# Altium schematic sheet SF_driver.SchDoc
size 420 x 297 mm; Address1: Address1; Address2: Address2; Address3: Address3; Address4: Address4; DocumentNumber: *Э3; SheetNumber: 15; SheetTotal: 15; DocumentType: Схема электрическая *
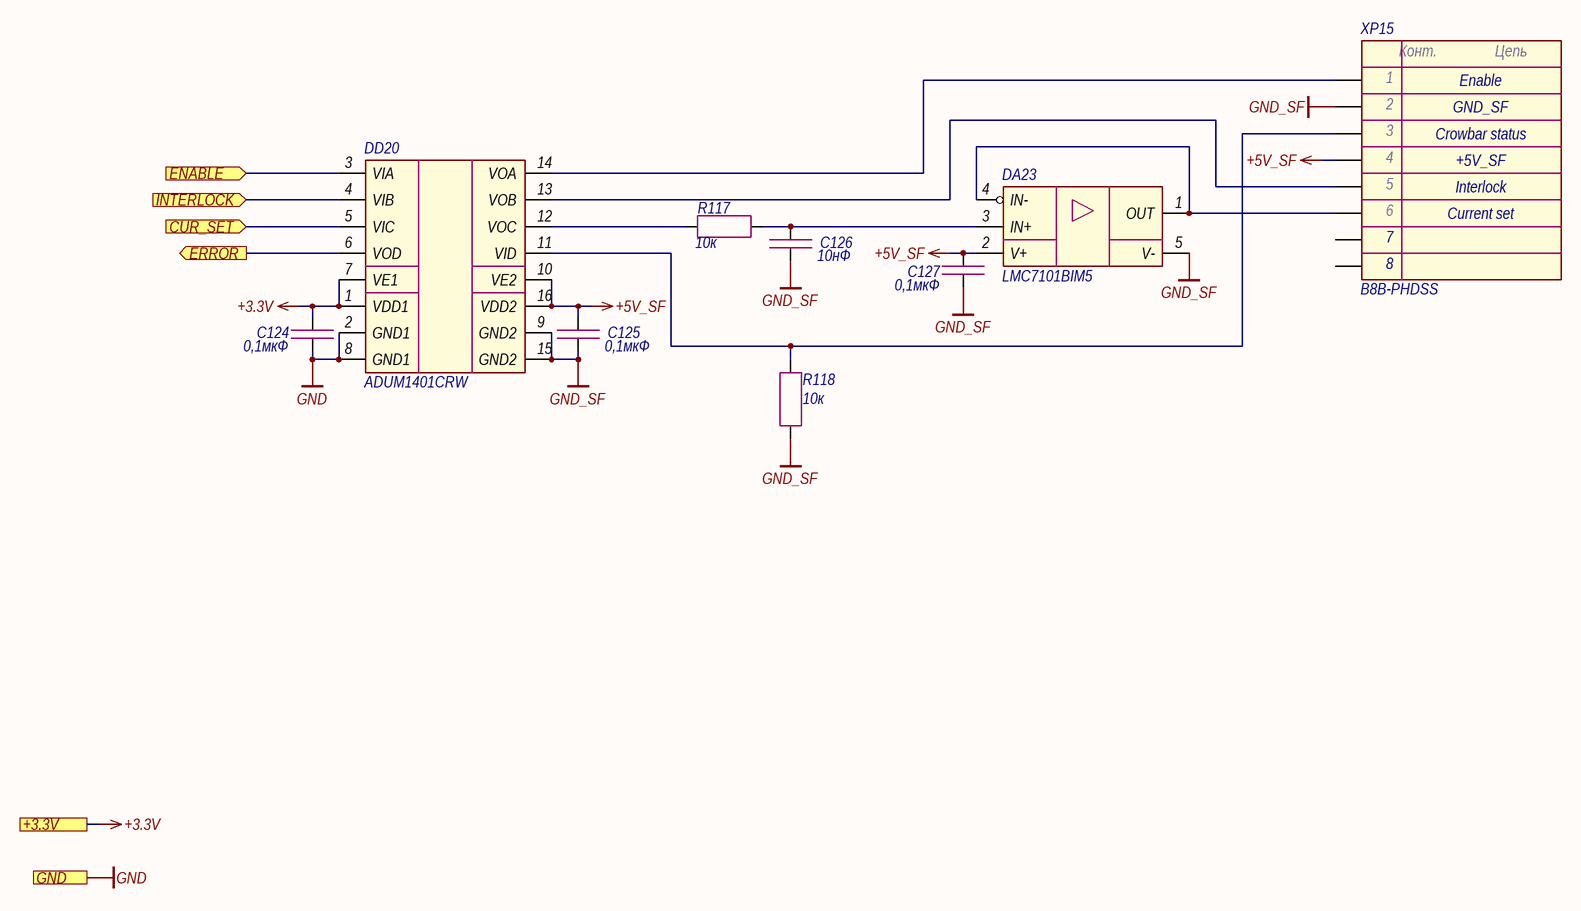
[diagram p0: SF_driver.SchDoc]

## Parts
C124  0,1мкФ  [CAP_0603]
C125  0,1мкФ  [CAP_0603]
C126  10нФ  [CAP_0603]
C127  0,1мкФ  [CAP_0603]
DA23  LMC7101BIM5  [SOT-23-5]
DD20  ADUM1401CRW  [SOIC-16W]
R117  10к  [RES_0603]
R118  10к  [RES_0603]
XP15  B8B-PHDSS  [B8B-PHDSS]

## Ports
+3.3V (see Main[1D], Button[1D], Ethernet[3D], Fiber_interlock[2C], Flow_sensor[2C], Hardwiring[3D], LD_driver[1D], Power_supply[1D], Power_supply_CAN[1D]), CUR_SET (in, see Main[1D]), ENABLE (in, see Main[1D]), ERROR (out, see Main[1D]), GND (see Main[1D], Button[1D], Column[1C], Ethernet[3D], Fiber_interlock[2C], Flow_sensor[2C], Guide_laser[1C], Hardwiring[3D], Indication[1C], LD_driver[1D], Power_supply[1D], Power_supply_CAN[1D]), INTERLOCK (in, see Main[1D])

## Nets
+3.3V: C124.1 DD20.1(VDD1) DD20.7(VE1) ; port +3.3V
+5V_SF: C125.1 C127.1 DA23.2(V+) DD20.10(VE2) DD20.16(VDD2) XP15.4
GND: C124.2 DD20.2(GND1) DD20.8(GND1) ; port GND
GND_SF: C125.2 C126.2 C127.2 DA23.5(V-) DD20.9(GND2) DD20.15(GND2) R118.1 XP15.2
CUR_SET: DD20.5(VIC) ; port CUR_SET
ENABLE: DD20.3(VIA) ; port ENABLE
ERROR: DD20.6(VOD) ; port ERROR
INTERLOCK: DD20.4(VIB) ; port INTERLOCK
NetC126_1: C126.1 DA23.3(IN+) R117.2
NetDA23_1: DA23.1(OUT) DA23.4(IN-) XP15.6
NetDD20_11: DD20.11(VID) R118.2 XP15.3
NetDD20_12: DD20.12(VOC) R117.1
NetDD20_13: DD20.13(VOB) XP15.5
NetDD20_14: DD20.14(VOA) XP15.1

Not connected (* = marked no-connect by the designer): XP15 7 8

## Notes on the sheet
- Crowbar status
- Enable
- GND_SF
- Interlock
- +5V_SF
- Current set
- Подп. и дата
- Инв. № дубл.
- Взам. инв. №
- Инв. № подл.
- Изм.
- Лист
- № докум.
- Подп.
- Дата
- Копировал
- Формат А3
- (in symbol Connector-8) Конт.; Цепь

## Library data of the parts
C124 C125 C127 = Capacitor: Manufacturer: Murata; Model: GRM188R71H104KA93D; Value: 0,1мкФ; Document: *
C126 = Capacitor: Manufacturer: Murata; Model: GRM188R71H103JA01D; Value: 10нФ; Document: *
DA23 = LMC7101: Manufacturer: Texas Instruments; Model: LMC7101BIM5; Document: *
DD20 = ADUM1401: Manufacturer: Analog Devices; Model: ADUM1401CRW; Document: *
R117 R118 = Resistor: Manufacturer: Yageo; Model: RC0603FR-0710KL; Value: 10к; Document: *
XP15 = Connector-8: Manufacturer: JST; Model: B8B-PHDSS; Document: *